# EAGLE design Spannungsversorgung_V1 (EAGLE 9.6.2)
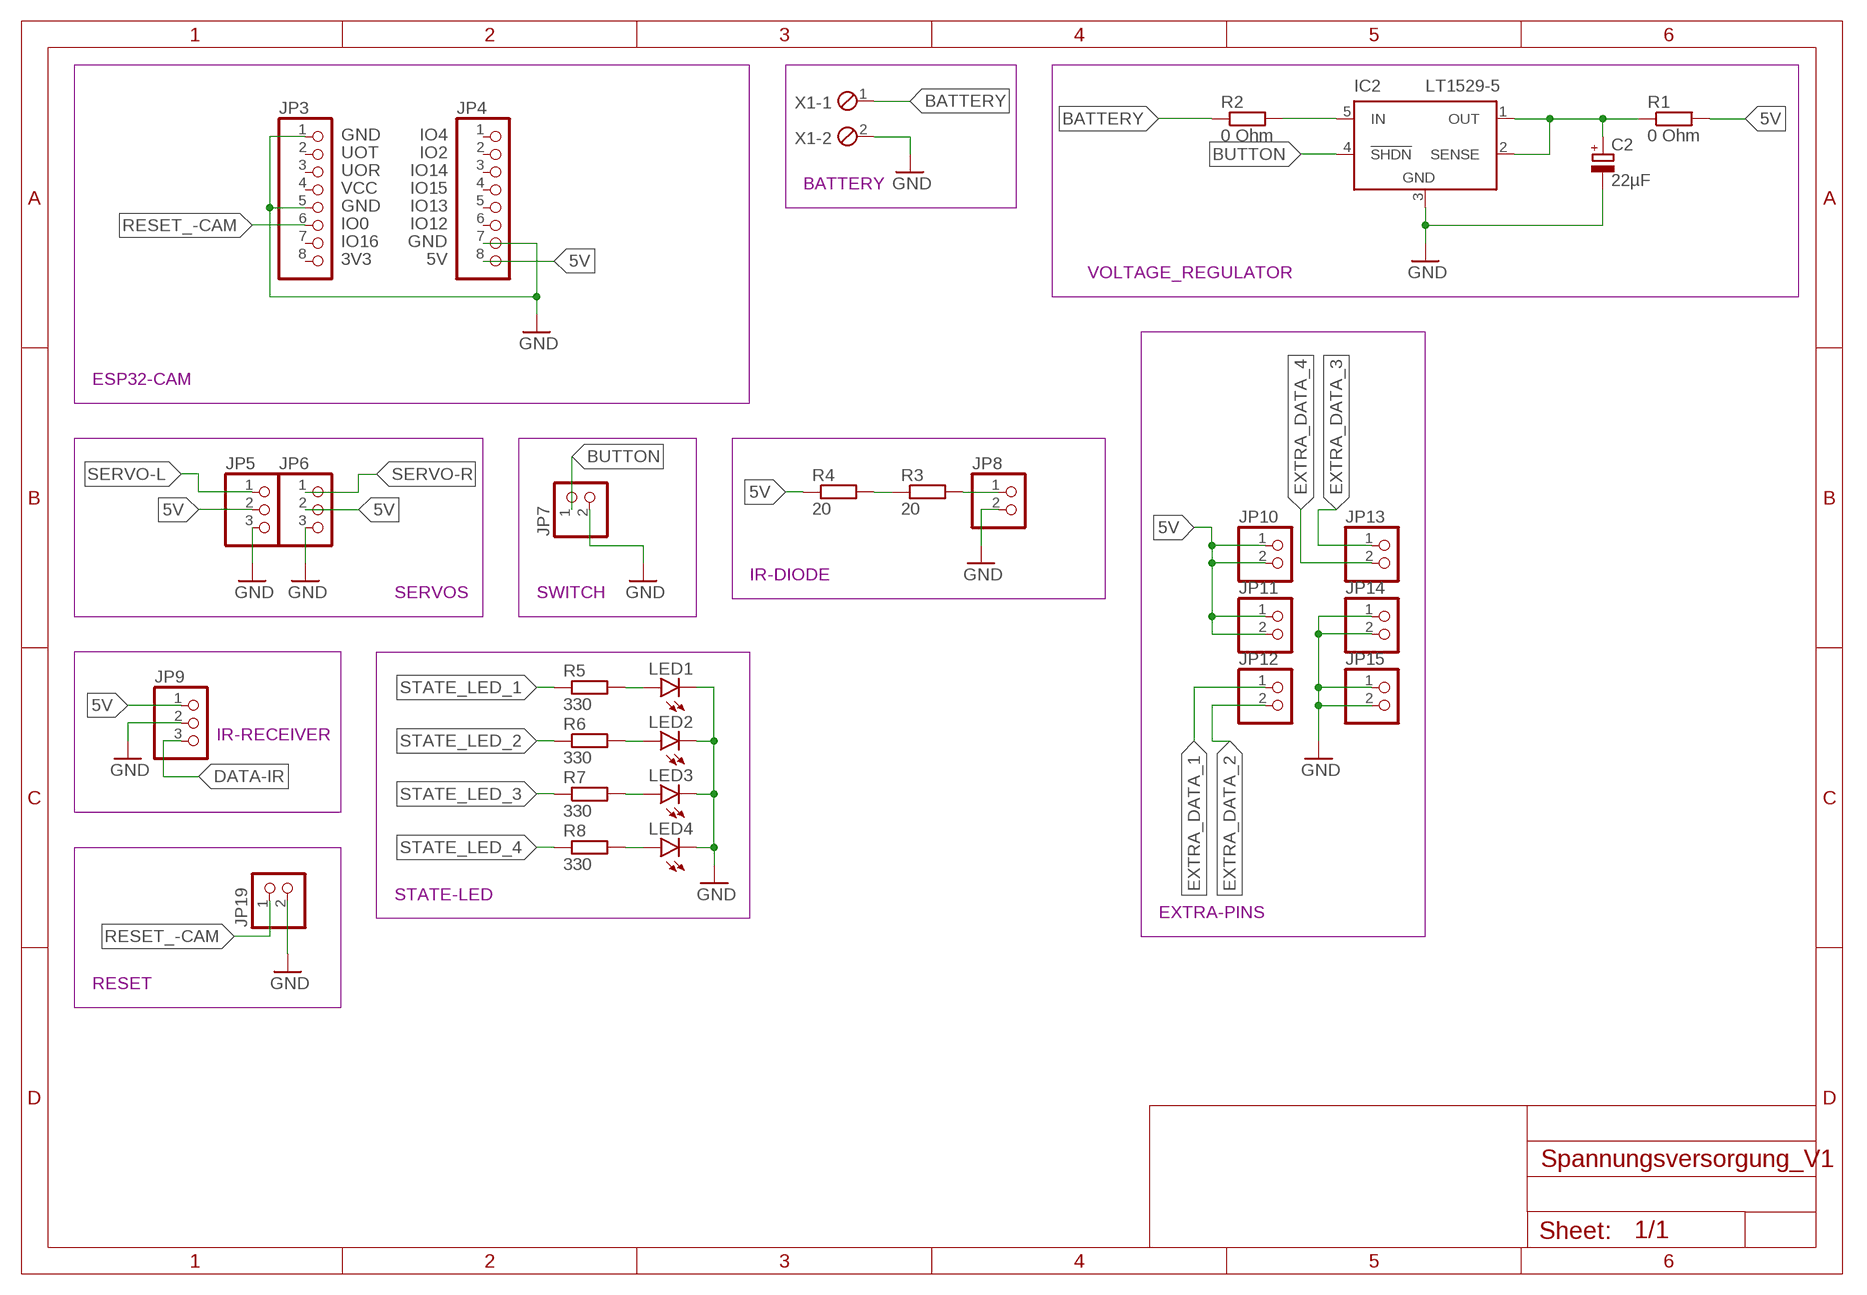
[diagram p0: schematic, sheet 1]

## Parts
C2  22µF  CPOL-EUE2.5-5  [E2,5-5]
IC2  LT1529-5  LT1529T  [TO220-5]
JP3  PINHD-1X8  [1X08]
JP4  PINHD-1X8  [1X08]
JP5  PINHD-1X3  [1X03]
JP6  PINHD-1X3  [1X03]
JP7  PINHD-1X2  [1X02]
JP8  PINHD-1X2  [1X02]
JP9  PINHD-1X3  [1X03]
JP10  PINHD-1X2  [1X02]
JP11  PINHD-1X2  [1X02]
JP12  PINHD-1X2  [1X02]
JP13  PINHD-1X2  [1X02]
JP14  PINHD-1X2  [1X02]
JP15  PINHD-1X2  [1X02]
JP19  PINHD-1X2  [1X02]
LED1  LED3MM  [LED3MM]
LED2  LED3MM  [LED3MM]
LED3  LED3MM  [LED3MM]
LED4  LED3MM  [LED3MM]
R1  0 Ohm  R-EU_R0805  [R0805]
R2  0 Ohm  R-EU_R0805  [R0805]
R3  20  R-EU_0309/12  [0309/12]
R4  20  R-EU_0309/12  [0309/12]
R5  330  R-EU_R0805  [R0805]
R6  330  R-EU_R0805  [R0805]
R7  330  R-EU_R0805  [R0805]
R8  330  R-EU_R0805  [R0805]
X1  MPT2  [2POL254]

## Nets
5V: JP4.8 JP5.2 JP6.2 JP9.1 JP10.1 JP10.2 JP11.1 JP11.2 R1.2 R4.1
BATTERY: R2.1 X1.1
BUTTON: IC2.4(!SHDN) JP7.1
DATA-IR: JP9.3
EXTRA_DATA_1: JP12.1
EXTRA_DATA_2: JP12.2
EXTRA_DATA_3: JP13.1
EXTRA_DATA_4: JP13.2
GND: C2.- IC2.3(GND) JP3.1 JP3.5 JP4.7 JP5.3 JP6.3 JP7.2 JP8.2 JP9.2 JP14.1 JP14.2 JP15.1 JP15.2 JP19.2 LED1.K(C) LED2.K(C) LED3.K(C) LED4.K(C) X1.2
N$1: R3.1 R4.2
N$2: JP8.1 R3.2
N$3: IC2.5(IN) R2.2
N$4: C2.+ IC2.1(OUT) IC2.2(SENSE) R1.1
N$5: LED1.A R5.2
N$6: LED2.A R6.2
N$7: LED3.A R7.2
N$8: LED4.A R8.2
RESET_-CAM: JP3.6 JP19.1
SERVO-L: JP5.1
SERVO-R: JP6.1
STATE_LED_1: R5.1
STATE_LED_2: R6.1
STATE_LED_3: R7.1
STATE_LED_4: R8.1
Unconnected: JP3.2 JP3.3 JP3.4 JP3.7 JP3.8 JP4.1 JP4.2 JP4.3 JP4.4 JP4.5 JP4.6

## Notes on the sheet
- GND | IO4
- UOT | IO2
- UOR | IO14
- VCC | IO15 | BATTERY
- GND | IO13
- IO0 | IO12
- IO16 | GND
- 3V3 | 5V
- VOLTAGE_REGULATOR
- ESP32-CAM
- IR-DIODE
- SERVOS | SWITCH
- IR-RECEIVER
- STATE-LED
- EXTRA-PINS
- RESET

## Library data of the parts
C2 = rcl:CPOL-EU: POLARIZED CAPACITOR, European symbol; SPICEPREFIX: C
IC2 = ltc1440_lt1529_ds1302:LT1529: LT1529 5 Volt LDO Regulator 5 Volt, 3 Ampere Low Dropout voltage regulator.
JP3 JP4 = pinhead:PINHD-1X8: PIN HEADER
JP5 JP6 JP9 = pinhead:PINHD-1X3: PIN HEADER
JP7 JP8 JP10-JP15 JP19 = pinhead:PINHD-1X2: PIN HEADER
LED1-LED4 = led:LED: LED OSRAM: - CHIPLED LG R971, LG N971, LY N971, LG Q971, LY Q971, LO R971, LY R971 LH N974, LH R974 LS Q976, LO Q976, LY Q976 LO Q996 - Hyper CHIPLED LW Q18S LB Q993, LB Q99A, LB R99A - SideLED LS A670, LO A670, LY A670, LG A670, LP A670 LB A673, LV A673, LT A673, LW A673 LH A674 LY A675 LS A676, LA A676, LO A676, LY A676, LW A676 LS A679, LY A679, LG A679 - Hyper Micro SIDELED® LS Y876, LA Y876, LO Y876, LY Y876 LT Y87S - SmartLED LW L88C, LW L88S LB L89C, LB L89S, LG L890 LS L89K, LO L89K, LY L89K LS L896, LA L896, LO L896, LY L896 - TOPLED LS T670, LO T670, LY T670, LG T670, LP T670 LSG T670, LSP T670, LSY T670, LOP T670, LYG T670 LG T671, LOG T671, LSG T671 LB T673, LV T673, LT T673, LW T673 LH T674 LS T676, LA T676, LO T676, LY T676, LB T676, LH T676, LSB T676, LW T676 LB T67C, LV T67C, LT T67C, LS T67K, LO T67K, LY T67K, LW E67C LS E67B, LA E67B, LO E67B, LY E67B, LB E67C, LV E67C, LT E67C LW T67C LS T679, LY T679, LG T679 LS T770, LO T770, LY T770, LG T770, LP T770 LB T773, LV T773, LT T773, LW T773 LH T774 LS E675, LA E675, LY E675, LS T675 LS T776, LA T776, LO T776, LY T776, LB T776 LHGB T686 LT T68C, LB T68C - Hyper Mini TOPLED® LB M676 - Mini TOPLED Santana® LG M470 LS M47K, LO M47K, LY M47K Source: http://www.osram.convergy.de LUXEON: - LUMILED® LXK2-PW12-R00, LXK2-PW12-S00, LXK2-PW14-U00, LXK2-PW14-V00 LXK2-PM12-R00, LXK2-PM12-S00, LXK2-PM14-U00 LXK2-PE12-Q00, LXK2-PE12-R00, LXK2-PE12-S00, LXK2-PE14-T00, LXK2-PE14-U00 LXK2-PB12-K00, LXK2-PB12-L00, LXK2-PB12-M00, LXK2-PB14-N00, LXK2-PB14-P00, LXK2-PB14-Q00 LXK2-PR12-L00, LXK2-PR12-M00, LXK2-PR14-Q00, LXK2-PR14-R00 LXK2-PD12-Q00, LXK2-PD12-R00, LXK2-PD12-S00 LXK2-PH12-R00, LXK2-PH12-S00 LXK2-PL12-P00, LXK2-PL12-Q00, LXK2-PL12-R00 Source: www.luxeon.com KINGBRIGHT: KA-3528ASYC Source: www.kingbright.com
R1-R8 = rcl:R-EU_: RESISTOR, European symbol; SPICEPREFIX: R
X1 = con-phoenix-254:MPT2: PHOENIX CONNECTOR; OC_FARNELL: unknown; OC_NEWARK: unknown

## Board
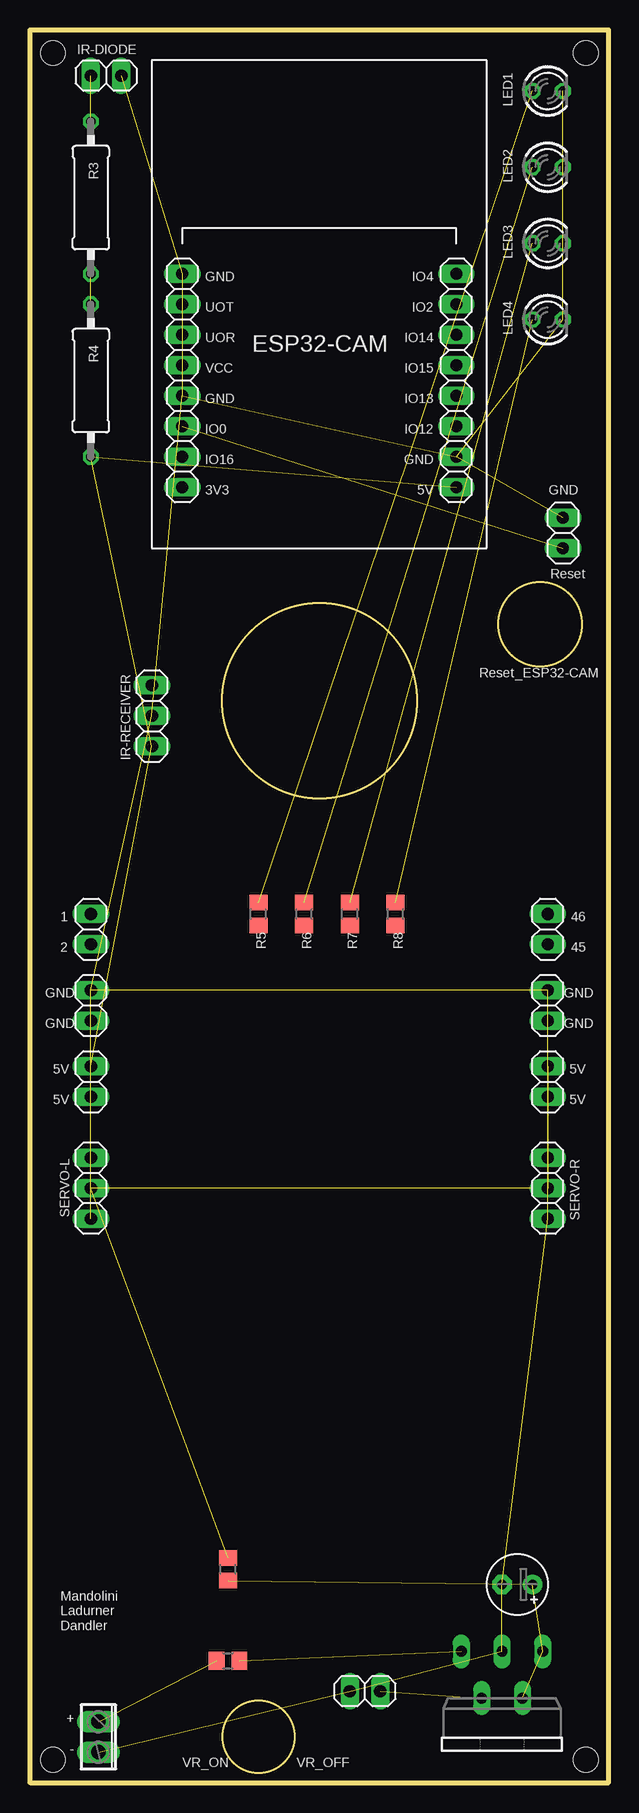
[diagram p1: board, top side]
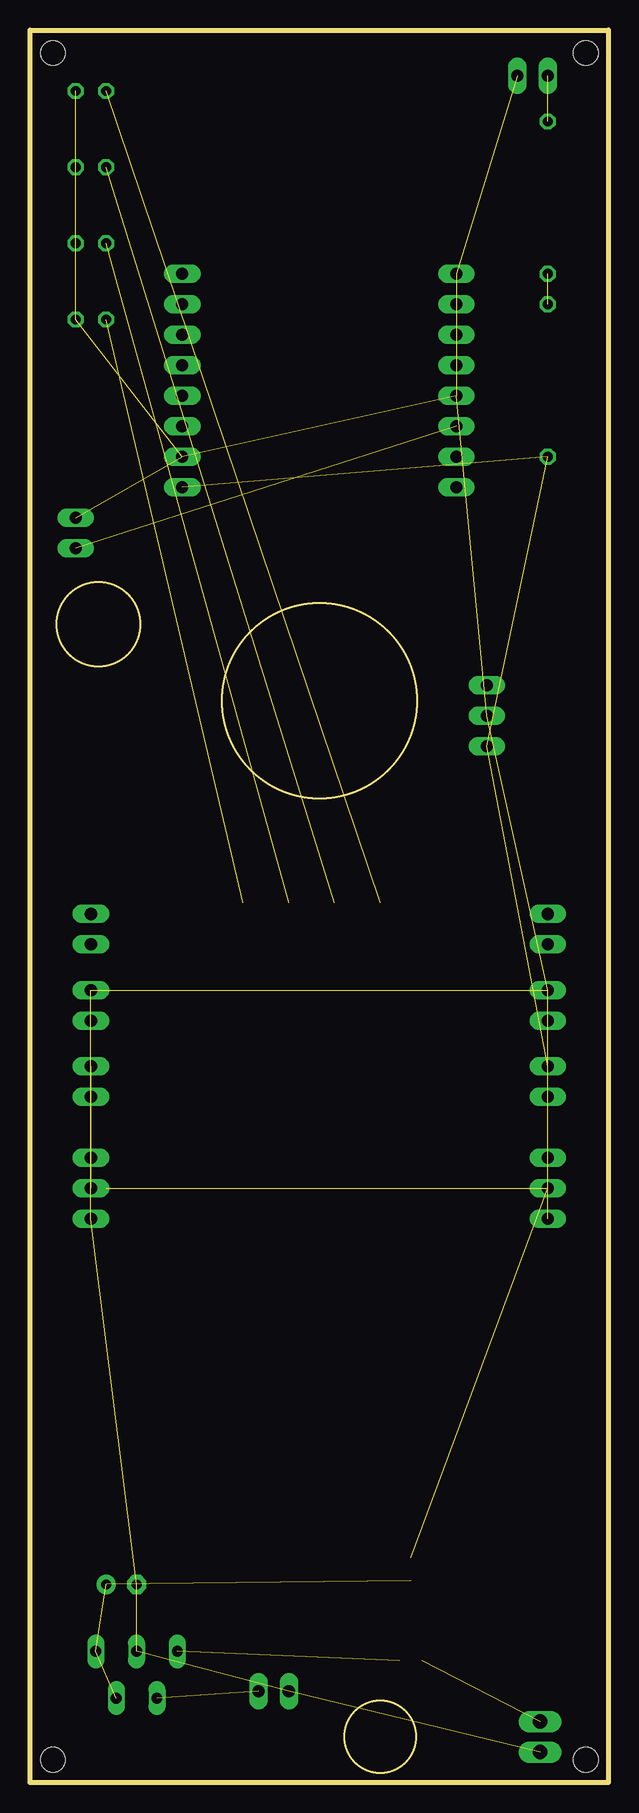
[diagram p2: board, bottom side, seen from below]

Size 48.26 x 146.05 mm. Coordinates in mm from the lower left corner, seen from the top.
Outline: 0,0 48.26,0 48.26,146.05 0,146.05 0,0
Copper layers (1*16): Top 0.035mm / dielectric 1.5mm / Bottom 0.035mm
Design rules "default *": minimum track width 6mil, minimum drill 0.35mm, track to track 12mil, track to pad 12mil, pad to pad 12mil, via to via 12mil, smd to smd 12mil, copper to edge 40mil, drill to drill 12mil, minimum pad ring 10mil, minimum via ring 8mil, stop-mask expansion 4mil, vias tented up to drill 0mil, thermal gap 10mil
Holes 2.03 mm at 1.91,1.91 46.36,1.91 46.36,144.15 1.91,144.15
Milling: area 16,82 to 32.3,98.3; area 16.1,0.8 to 22,6.8; area 39,93 to 46,100

### Footprints (pad centres in the part's own frame; a part is rotated, then mirrored left to right if it is on the bottom)
E2,5-5 = drill 0.813 pad 1.6: + -1.27,0 | drill 0.813 pad 1.6 octagon: - 1.27,0
TO220-5 = drill 0.9 long: 1 -3.4,-8.4; 2 -1.7,-4.5; 3 0,-8.4; 4 1.7,-4.5; 5 3.4,-8.4
1X08 = drill 1.016 long: 1 -8.89,0; 2 -6.35,0; 3 -3.81,0; 4 -1.27,0; 5 1.27,0; 6 3.81,0; 7 6.35,0; 8 8.89,0
1X03 = drill 1.016 long: 1 -2.54,0; 2 0,0; 3 2.54,0
1X02 = drill 1.016 long: 1 -1.27,0; 2 1.27,0
LED3MM = drill 0.813 octagon: A -1.27,0; K 1.27,0
R0805 = smd 1.3 x 1.5: 1 -0.95,0; 2 0.95,0
0309/12 = drill 0.813 octagon: 1 -6.35,0; 2 6.35,0
2POL254 = drill 1.2 long: 1 -1.27,0; 2 1.27,0

### Placement (x,y rotation side)
C2  40.64,16.51 180 top
IC2  39.37,2.54 180 top
JP3  12.7,116.84 270 top
JP4  35.56,116.84 270 top
JP5  5.08,49.53 270 top
JP6  43.18,49.53 270 top
JP7  27.94,7.62 180 top
JP8  6.35,142.24 0 top
JP9  10.16,88.9 90 top
JP10  5.08,58.42 90 top
JP11  43.18,58.42 90 top
JP12  5.08,71.12 90 top
JP13  43.18,71.12 90 top
JP14  5.08,64.77 90 top
JP15  43.18,64.77 90 top
JP19  44.45,104.14 90 top
LED1  43.18,140.97 0 top
LED2  43.18,134.62 0 top
LED3  43.18,128.27 0 top
LED4  43.18,121.92 0 top
R1  16.51,17.78 90 top
R2  16.51,10.16 0 top
R3  5.08,132.08 90 top
R4  5.08,116.84 90 top
R5  19.05,72.39 90 top
R6  22.86,72.39 90 top
R7  26.67,72.39 90 top
R8  30.48,72.39 90 top
X1  5.71,3.81 270 top

### Tracks (layer width: path | path; a pad name or v marks a point on that pad's centre or on a via)
5V  (9 unrouted)
  Top 0.406: JP6.2 41.91,49.53
BATTERY  (1 unrouted)
BUTTON  (1 unrouted)
GND  (19 unrouted)
  Bottom 0.406: JP5.3 3.81,46.99 | 3.81,63.5 JP14.1
N$1  (1 unrouted)
N$2  (1 unrouted)
N$3  (1 unrouted)
N$4  (3 unrouted)
N$5  (1 unrouted)
N$6  (1 unrouted)
N$7  (1 unrouted)
N$8  (1 unrouted)
RESET_-CAM  (1 unrouted)

### Text on the board
tPlace: ESP32-CAM
tNames: IR-DIODE | GND | IO4 | UOT | IO2 | UOR | IO14 | VCC | IO15 | GND | IO13 | IO0 | IO12 | IO16 | GND | 3V3 | 5V | GND | Reset | Reset_ESP32-CAM | IR-RECEIVER | 1 | 46 | 2 | 45 | GND | GND | GND | GND | 5V | 5V | 5V | 5V | SERVO-L | SERVO-R | Mandolini / Ladurner / Dandler | + | - | VR_ON | VR_OFF